# Altium schematic sheet Ethernet.SchDoc: Ethernet PHY with RJ45 connector
size A4; Date: 29-OCT-2015; Author: A.B; CompanyName: STMicroelectronics; Organization: MCD/TOOLS/GNB; Address1: 12, Rue Jules HOROWITZ; Address2: 38019 Grenoble; Address3: FRANCE; DocumentNumber: MB1225; Revision: B-01; SheetNumber: 10; SheetTotal: 13; Project: STM32F769I-DISCO
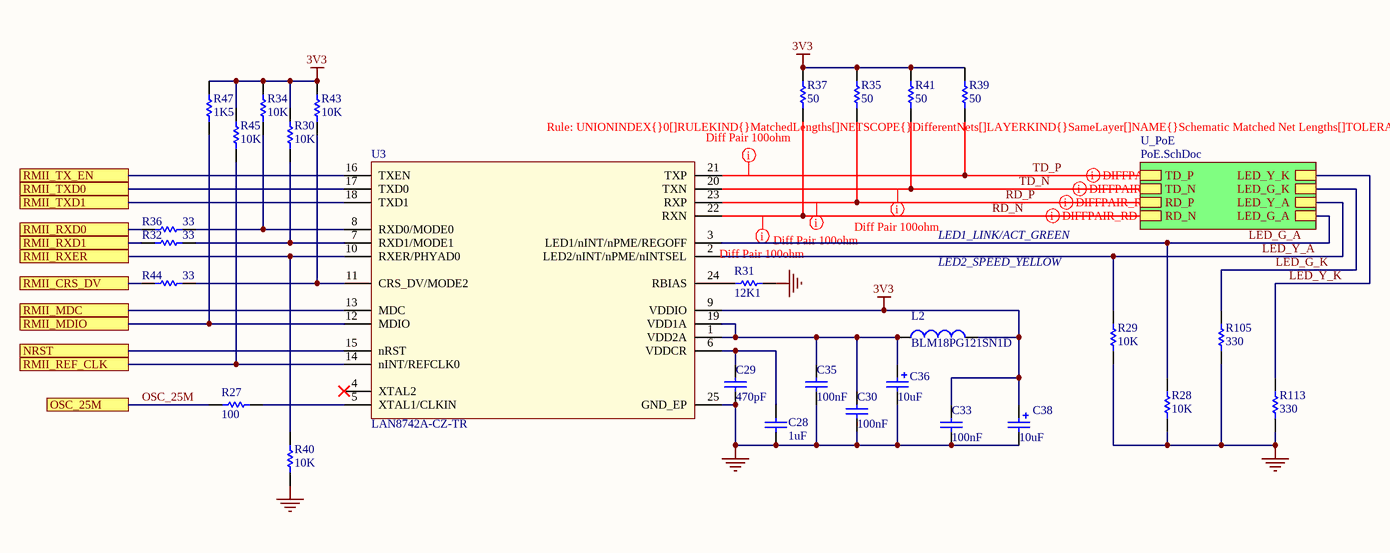
[diagram p0: Ethernet.SchDoc]

## Parts
C28  1uF  [0603C]
C29  470pF  [0402C]
C30  100nF  [0402C]
C33  100nF  [0402C]
C35  100nF  [0402C]
C36  10uF  [TAN-A]
C38  10uF  [TAN-A]
L2  BLM18PG121SN1D  [0603L]
R27  100  [0402R]
R28  10K  [0402R]
R29  10K  [0402R]
R30  10K  [0402R]
R31  12K1  [0603R]
R32  33  [0402R]
R34  10K  [0402R]
R35  50  [0402R]
R36  33  [0402R]
R37  50  [0402R]
R39  50  [0402R]
R40  10K  [0402R]
R41  50  [0402R]
R43  10K  [0402R]
R44  33  [0402R]
R45  10K  [0402R]
R47  1K5  [0402R]
R105  330  [0402R]
R113  330  [0402R]
U3  LAN8742A-CZ-TR  [QFN24_0R5_4X4]

## Sub-sheets
U_PoE = PoE.SchDoc: LED_G_A, LED_G_K, LED_Y_A, LED_Y_K, RD_P, TD_N, TD_P, RD_N

## Ports
NRST, OSC_25M, RMII_CRS_DV, RMII_MDC, RMII_MDIO, RMII_REF_CLK, RMII_RXD0, RMII_RXD1, RMII_RXER, RMII_TX_EN, RMII_TXD0, RMII_TXD1

## Nets
3V3: C33.2 C38.1 L2.2 R30.2 R34.2 R35.1 R37.1 R39.1 R41.1 R43.2 R45.2 R47.2 U3.9(VDDIO)
GND: C28.1 C29.1 C30.1 C33.1 C35.1 C36.2 C38.2 R28.1 R29.1 R31.2 R40.1 R105.1 R113.1 U3.25(GND_EP)
LED_G_A: R28.2 U3.3(LED1/nINT/nPME/REGOFF) ; sheet U_PoE/LED_G_A
LED_G_K: R105.2 ; sheet U_PoE/LED_G_K
LED_Y_A: R29.2 U3.2(LED2/nINT/nPME/nINTSEL) ; sheet U_PoE/LED_Y_A
LED_Y_K: R113.2 ; sheet U_PoE/LED_Y_K
NRST: U3.15(nRST) ; port NRST
OSC_25M: R27.1 ; port OSC_25M
RD_N: R37.2 U3.22(RXN) ; sheet U_PoE/RD_N
RD_P: R35.2 U3.23(RXP) ; sheet U_PoE/RD_P
RMII_CRS_DV: R44.2 ; port RMII_CRS_DV
RMII_MDC: U3.13(MDC) ; port RMII_MDC
RMII_MDIO: R47.1 U3.12(MDIO) ; port RMII_MDIO
RMII_REF_CLK: R45.1 U3.14(nINT/REFCLK0) ; port RMII_REF_CLK
RMII_RXD0: R36.2 ; port RMII_RXD0
RMII_RXD1: R32.2 ; port RMII_RXD1
RMII_RXER: R40.2 U3.10(RXER/PHYAD0) ; port RMII_RXER
RMII_TX_EN: U3.16(TXEN) ; port RMII_TX_EN
RMII_TXD0: U3.17(TXD0) ; port RMII_TXD0
RMII_TXD1: U3.18(TXD1) ; port RMII_TXD1
TD_N: R41.2 U3.20(TXN) ; sheet U_PoE/TD_N
TD_P: R39.2 U3.21(TXP) ; sheet U_PoE/TD_P
NetC28_2: C28.2 C29.2 U3.6(VDDCR)
NetC30_2: C30.2 C35.2 C36.1 L2.1 U3.1(VDD2A) U3.19(VDD1A)
NetR27_2: R27.2 U3.5(XTAL1/CLKIN)
NetR30_1: R30.1 R32.1 U3.7(RXD1/MODE1)
NetR31_1: R31.1 U3.24(RBIAS)
NetR34_1: R34.1 R36.1 U3.8(RXD0/MODE0)
NetR43_1: R43.1 R44.1 U3.11(CRS_DV/MODE2)

Not connected (* = marked no-connect by the designer): U3 4(XTAL2)*

## Layout directives
differential pair: RD_N, RD_P, TD_N, TD_P
rule Matched Net Lengths [Tolerance = 100mil]: RD_N, RD_P, TD_N, TD_P

## Notes on the sheet
- LED2_SPEED_YELLOW
- LED1_LINK/ACT_GREEN
- Title:
- Project:
- Size:
- Revision:
- Variant:
- A4
- -
- Date:
- Reference:
- Sheet:
- of

## Library data of the parts
C28 = Cap_1uF_X5R_10%_0603: Capacitor,1uF,16V,X5R,10%,0603,YAGEO; Manuf_Part_1: CC0603KRX5R7BB105; Revision: July-2002: Re-released for DXP Platform.; Value: 1uF; Order: CC0603KRX5R7BB105; Manuf_1: YAGEO; ECCN_US/EU: n/a
C29 = Cap_470pF_X7R_10%_0402: Capacitor,470pF,16V,X7R,10%,0402,YAGEO; Manuf_Part_1: 0402YC471KAT4A; Revision: July-2002: Re-released for DXP Platform.; Value: 470pF; Order: 0402YC471KAT4A; Manuf_1: YAGEO; ECCN_US/EU: n/a
C30 C33 C35 = Cap_100nF_X7R_10%_0402: Capacitor,100nF,16V,X7R,10%,0402,YAGEO; Manuf_Part_1: CC0402KRX7R7BB104; Revision: July-2002: Re-released for DXP Platform.; Value: 100nF; Order: CC0402KRX7R7BB104; Manuf_1: YAGEO
C36 C38 = Cap_10uF_POL_10%_TANA: Polarized Capacitor,10uF,10V,10%,typeA,VISHAY; Manuf_Part_1: 293D106X9010A2TE3; Revision: July-2002: Re-released for DXP Platform.; Value: 10uF; Manuf_1: VISHAY; Order: *; ECCN_US/EU: n/a
L2 = BEAD_120R_2A_0603: Bead,120R,2A,0603,BLM18PG121SN1D,MURATA; Manuf_Part_3: FCM1608KF-601T03; Manuf_2: TDK; Manuf_Part_2: MPZ1608S300A; Manuf_3: Tai-tech; Value: 100uH; Description_3: Bead,600R,350mA,0603,FCM1608KF-601T03,Tai-tech; Description_2: Bead,30R,5A,0603,MPZ1608S300A,TDK; Revision: July-2002: Re-released for DXP Platform.; ECCN_US/EU: n/a; Manuf_Part_1: BLM18PG121SN1D; Manuf_1: MURATA
R27 = Res_100_1%_0402: Resistor,100,0402,1%,YAGEO; Manuf_Part_1: RC0402FR-07100RL; Order: 9239111; Value: 100; Manuf_1: YAGEO; ECCN_US/EU: n/a; Distrib: FARNELL
R28-R30 R34 R40 R43 R45 = Res_10K_1%_0402: Resistor,10K,0402,1%,YAGEO; Manuf_Part_1: RC0402FR-0710KL; Value: 10K; Manuf_1: YAGEO; Order: RC0402FR-0710KL; ECCN_US/EU: n/a
R31 = Res_12K1_1%_0603: Resistor,12K1,0603,1%,VISHAY; Manuf_Part_1: MCT 0603-50 1% P5 12K1; Order: 2325243; Value: 12K1; ECCN_US/EU: n/a; Manuf_1: VISHAY; Distrib: FARNELL
R32 R36 R44 = Res_33_1%_0402: Resistor,33,0402,1%,YAGEO; Manuf_Part_1: RC0402FR-0733RL; Value: 33; Manuf_1: YAGEO; Order: *; ECCN_US/EU: n/a; Distrib: FARNELL
R35 R37 R39 R41 = Res_50_1%_0402: Resistor,50,0402,1%,YAGEO; Manuf_Part_1: RC0402FR-0750RL; Value: 50; Manuf_1: YAGEO; Order: *; ECCN_US/EU: n/a; Distrib: FARNELL
R47 = Res_1K5_1%_0402: Resistor,1K5,0402,1%,YAGEO; Manuf_Part_1: RC0402FR-071K5L; Value: 1K5; Manuf_1: YAGEO; Order: RC0402FR-071K5L; ECCN_US/EU: n/a; Distrib: FARNELL
R105 R113 = Res_330_1%_0402: Resistor,330,0402,1%,YAGEO; Manuf_Part_1: RC0402FR-07330RL; Value: 330; ECCN_US/EU: n/a; Manuf_1: YAGEO; Distrib: DIGIKEY; Order: RC0402FR-07330RL
U3 = LAN8742A-CZ-TR: LAN8742A-CZ-TR - Small Footprint RMII 10/100 Ethernet, Transceiver with HP Auto-MDIX and flexPWR Technology SQFN-24; Manuf_1: MICROCHIP; ECCN_US/EU: EAR99/NEC; Provided: Sub Co; Order: LAN8742A-CZ-TR; Manuf_Part_1: LAN8742A-CZ-TR; Distrib: MICROCHIP